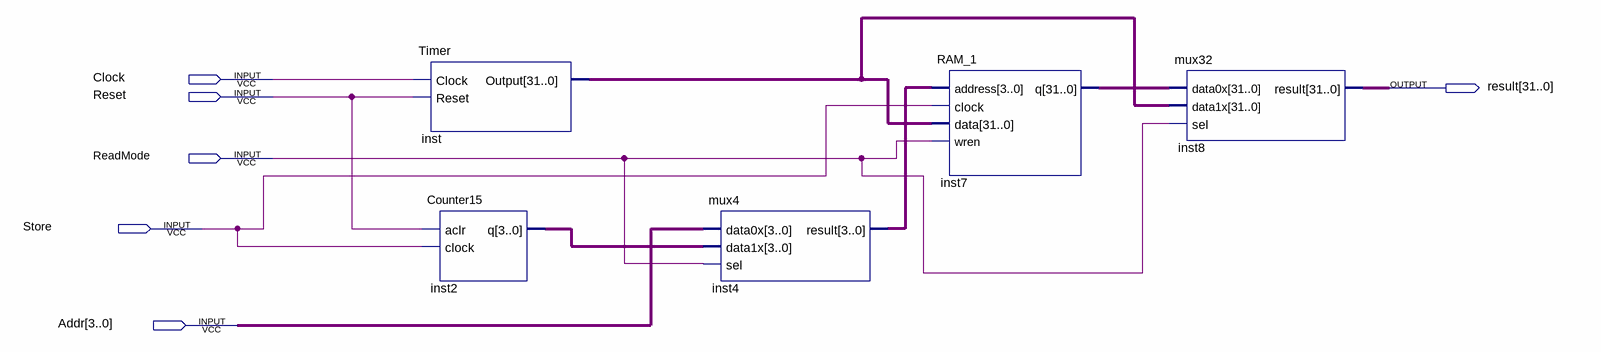
[diagram p0: schematic sheet]
// Quartus schematic Full2.bdf as structural Verilog: 5 symbols, 6 pins
module Full2 (
  input  Clock,
  input  Reset,
  input  ReadMode,
  input  Store,
  input  [3:0] Addr,
  output [31:0] result
);

  wire [3:0] inst2_q, inst4_result;
  wire [31:0] inst7_q, inst_output;

  Timer inst (.Clock(Clock), .Reset(Reset), .Output(inst_output));
  Counter15 inst2 (.aclr(Reset), .clock(Store), .q(inst2_q));
  mux4 inst4 (.data0x(Addr), .data1x(inst2_q), .sel(ReadMode), .result(inst4_result));
  RAM_1 inst7 (.address(inst4_result), .clock(Store), .data(inst_output), .wren(ReadMode), .q(inst7_q));
  mux32 inst8 (.data0x(inst7_q), .data1x(inst_output), .sel(ReadMode), .result(result));
endmodule
